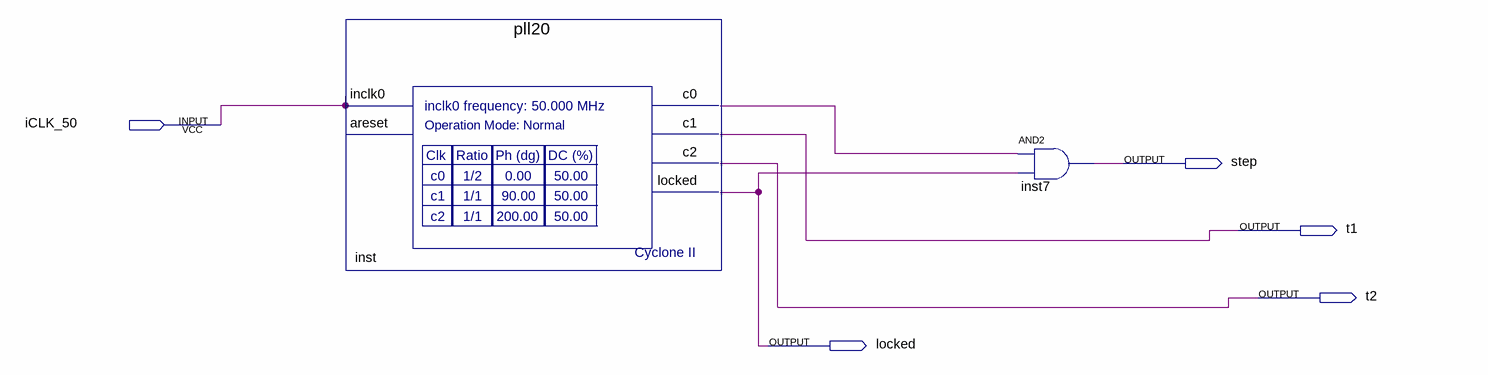
[diagram p0: schematic sheet]
// Quartus schematic pll_test.bdf as structural Verilog: 2 symbols, 5 pins
module pll_test (
  input  iCLK_50,
  output step,
  output t1,
  output t2,
  output locked
);

  wire inst_c0;

  pll20 inst (.inclk0(iCLK_50), .c0(inst_c0), .c1(t1), .c2(t2), .locked(locked));  // open: areset
  and inst7 (step, inst_c0, locked);
endmodule
